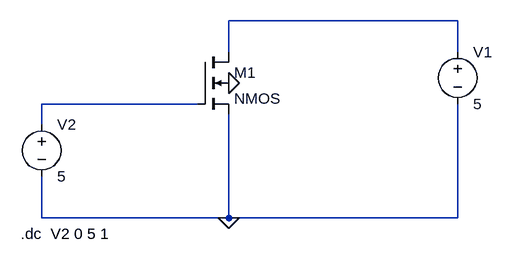
[diagram p0: schematic exp1.asc]
exp1.asc, the LTspice schematic file:
Version 4
SHEET 1 880 680
WIRE -2400 -1472 -2752 -1472
WIRE -2752 -1424 -2752 -1472
WIRE -2400 -1424 -2400 -1472
WIRE -2800 -1344 -3040 -1344
WIRE -3040 -1312 -3040 -1344
WIRE -3040 -1168 -3040 -1232
WIRE -2752 -1168 -2752 -1328
WIRE -2752 -1168 -3040 -1168
WIRE -2400 -1168 -2400 -1344
WIRE -2400 -1168 -2752 -1168
FLAG -2752 -1168 0
FLAG -2752 -1376 0
SYMBOL nmos4 -2800 -1424 R0
SYMATTR InstName M1
SYMBOL voltage -2400 -1440 R0
WINDOW 123 0 0 Left 2
WINDOW 39 0 0 Left 2
SYMATTR InstName V1
SYMATTR Value 5
SYMBOL voltage -3040 -1328 R0
WINDOW 123 0 0 Left 2
WINDOW 39 0 0 Left 2
SYMATTR InstName V2
SYMATTR Value 5
TEXT -3072 -1144 Left 2 !.dc  V2 0 5 1

The netlist it stands for:
* exp1.asc
M1 N001 N002 0 0 NMOS
V1 N001 0 5
V2 N002 0 5
.model NMOS NMOS
.model PMOS PMOS
.lib standard.mos
.dc  V2 0 5 1
.backanno
.end

* Results of the author's LTspice run, read from the files saved beside the schematic
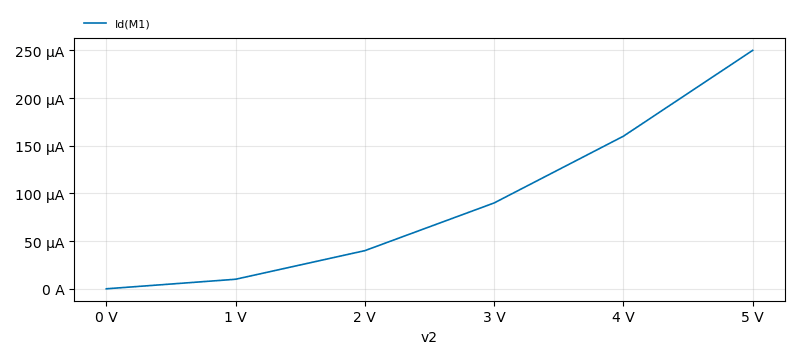
[diagram p1: DC transfer characteristic of exp1.asc, plotted from the saved traces]
* DC transfer characteristic, 1 run:
*   Id(M1): 10.01 pA at v2=0 V, 250 µA at v2=5 V, min 10.01 pA, max 250 µA